# EAGLE design traffic_light (EAGLE 9.5.2)
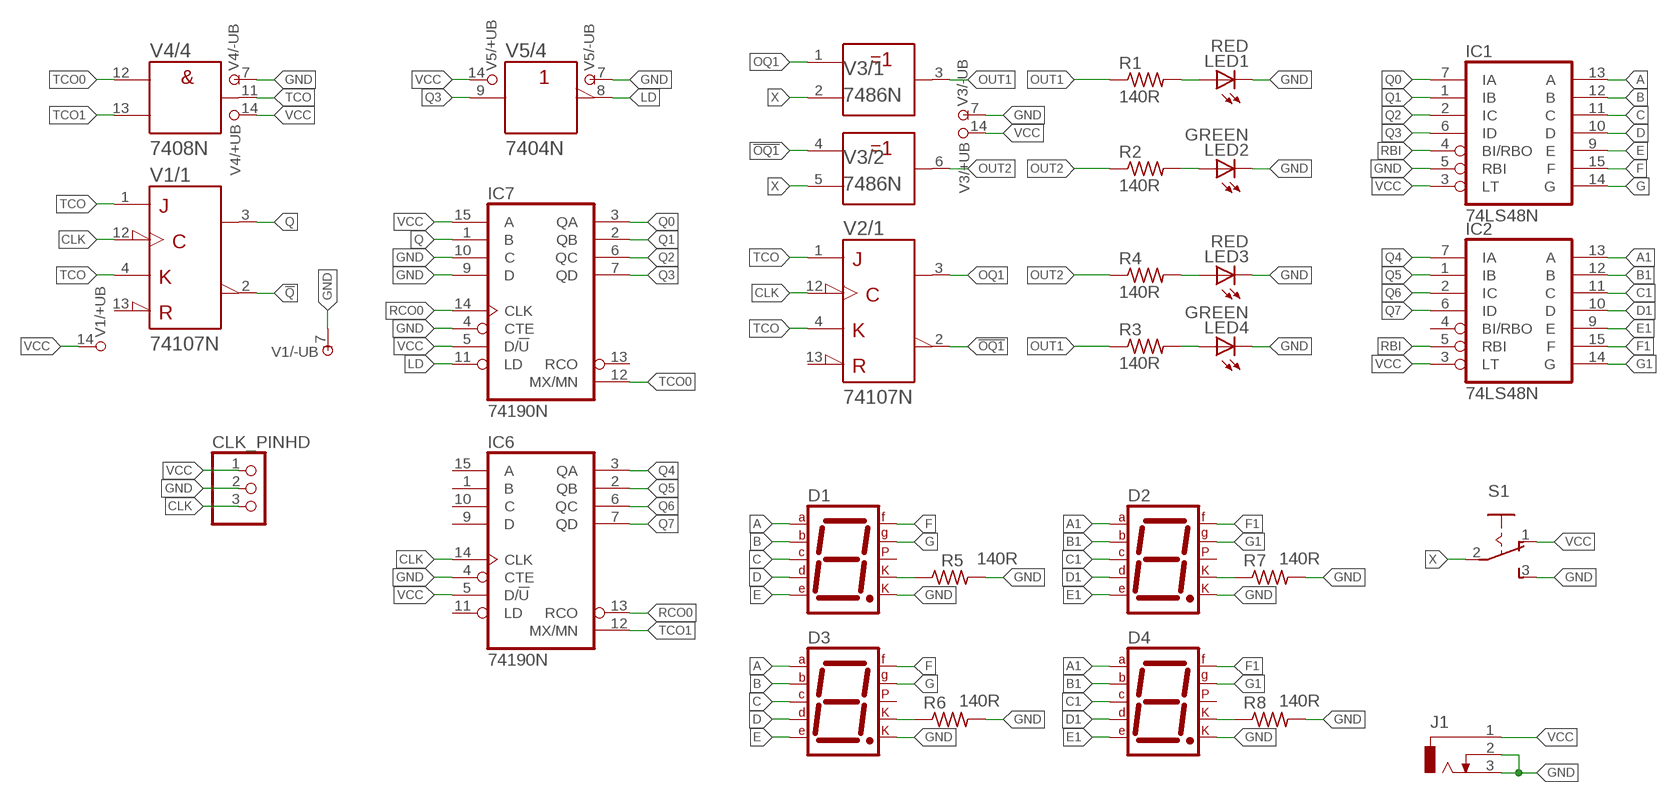
[diagram p0: schematic, sheet 1]

## Parts
CLK_PINHD  PINHD-1X3  [1X03]
D1  7SEG-CK  [7SEG-13]
D2  7SEG-CK  [7SEG-13]
D3  7SEG-CK  [7SEG-13]
D4  7SEG-CK  [7SEG-13]
IC1  74LS48N  [DIL16]
IC2  74LS48N  [DIL16]
IC6  74190N  [DIL16]
IC7  74190N  [DIL16]
J1  CON_JACK  [DCJ0303]
LED1  RED  LED5MM  [LED5MM]
LED2  GREEN  LED5MM  [LED5MM]
LED3  RED  LED5MM  [LED5MM]
LED4  GREEN  LED5MM  [LED5MM]
R1  140R  RES-7  [0204/7]
R2  140R  RES-7  [0204/7]
R3  140R  RES-7  [0204/7]
R4  140R  RES-7  [0204/7]
R5  140R  RES-7  [0204/7]
R6  140R  RES-7  [0204/7]
R7  140R  RES-7  [0204/7]
R8  140R  RES-7  [0204/7]
S1  255SB  [255SB]
V1  74107N  [DIL14]
V2  74107N  [DIL14]
V3  7486N  [DIL14]
V4  7408N  [DIL14]
V5  7404N  [DIL14]

## Nets
!OQ1: V2.2(/1:!Q) V3.4(/2:A)
!Q: V1.2(/1:!Q)
A: D1.7(A) D3.7(A) IC1.13(A)
A1: D2.7(A) D4.7(A) IC2.13(A)
B: D1.6(B) D3.6(B) IC1.12(B)
B1: D2.6(B) D4.6(B) IC2.12(B)
C: D1.4(C) D3.4(C) IC1.11(C)
C1: D2.4(C) D4.4(C) IC2.11(C)
CLK: CLK_PINHD.3 IC6.14(CLK) V1.12(/1:CLK) V2.12(/1:CLK)
D: D1.2(D) D3.2(D) IC1.10(D)
D1: D2.2(D) D4.2(D) IC2.10(D)
E: D1.1(E) D3.1(E) IC1.9(E)
E1: D2.1(E) D4.1(E) IC2.9(E)
F: D1.9(F) D3.9(F) IC1.15(F)
F1: D2.9(F) D4.9(F) IC2.15(F)
G: D1.10(G) D3.10(G) IC1.14(G)
G1: D2.10(G) D4.10(G) IC2.14(G)
GND: CLK_PINHD.2 D1.8(CK2) D2.8(CK2) D3.8(CK2) D4.8(CK2) IC1.5(RBI) IC6.4(CTE) IC7.4(CTE) IC7.9(D) IC7.10(C) J1.2 J1.3 LED1.K(C) LED2.K(C) LED3.K(C) LED4.K(C) R5.2 R6.2 R7.2 R8.2 S1.3(S) V1.7(/-UB:-UB) V3.7(/-UB:-UB) V4.7(/-UB:-UB) V5.7(/-UB:-UB)
LD: IC7.11(LD) V5.8(/4:Y)
N$1: D1.3(CK1) R5.1
N$2: D2.3(CK1) R7.1
N$3: D3.3(CK1) R6.1
N$4: D4.3(CK1) R8.1
N$27: LED1.A R1.2
N$29: LED2.A R2.2
N$31: LED3.A R4.2
N$33: LED4.A R3.2
OQ1: V2.3(/1:Q) V3.1(/1:A)
OUT1: R1.1 R3.1 V3.3(/1:Y)
OUT2: R2.1 R4.1 V3.6(/2:Y)
Q: IC7.1(B) V1.3(/1:Q)
Q0: IC1.7(IA) IC7.3(QA)
Q1: IC1.1(IB) IC7.2(QB)
Q2: IC1.2(IC) IC7.6(QC)
Q3: IC1.6(ID) IC7.7(QD) V5.9(/4:A)
Q4: IC2.7(IA) IC6.3(QA)
Q5: IC2.1(IB) IC6.2(QB)
Q6: IC2.2(IC) IC6.6(QC)
Q7: IC2.6(ID) IC6.7(QD)
RBI: IC1.4(BI/RBO) IC2.5(RBI)
RCO0: IC6.13(RCO) IC7.14(CLK)
TCO: V1.1(/1:J) V1.4(/1:K) V2.1(/1:J) V2.4(/1:K) V4.11(/4:Y)
TCO0: IC7.12(MX/MN) V4.12(/4:A)
TCO1: IC6.12(MX/MN) V4.13(/4:B)
VCC: CLK_PINHD.1 IC1.3(LT) IC2.3(LT) IC6.5(D/!U) IC7.5(D/!U) IC7.15(A) J1.1 S1.1(O) V1.14(/+UB:+UB) V3.14(/+UB:+UB) V4.14(/+UB:+UB) V5.14(/+UB:+UB)
X: S1.2(P) V3.2(/1:B) V3.5(/2:B)
Unconnected: D1.5(DP) D2.5(DP) D3.5(DP) D4.5(DP) IC2.4(BI/RBO) IC6.1(B) IC6.9(D) IC6.10(C) IC6.11(LD) IC6.15(A) IC7.13(RCO) V1.5(/2:Q) V1.6(/2:!Q) V1.8(/2:J) V1.9(/2:CLK) V1.10(/2:!CLR) V1.11(/2:K) V1.13(/1:!CLR) V2.5(/2:Q) V2.6(/2:!Q) V2.8(/2:J) V2.9(/2:CLK) V2.10(/2:!CLR) V2.11(/2:K) V2.13(/1:!CLR) V3.8(/3:Y) V3.9(/3:A) V3.10(/3:B) V3.11(/4:Y) V3.12(/4:A) V3.13(/4:B) V4.1(/1:A) V4.2(/1:B) V4.3(/1:Y) V4.4(/2:A) V4.5(/2:B) V4.6(/2:Y) V4.8(/3:Y) V4.9(/3:A) V4.10(/3:B) V5.1(/1:A) V5.2(/1:Y) V5.3(/2:A) V5.4(/2:Y) V5.5(/3:A) V5.6(/3:Y) V5.10(/5:Y) V5.11(/5:A) V5.12(/6:Y) V5.13(/6:A)

## Power pins joined to a net without a drawn wire
+UB: V2.14(/+UB:+UB)
-UB: V2.7(/-UB:-UB)
GND: IC1.8(GND) IC2.8(GND) IC6.8(GND) IC7.8(GND)
VCC: IC1.16(VCC) IC2.16(VCC) IC6.16(VCC) IC7.16(VCC)

## Library data of the parts
CLK_PINHD = MIA-Training:PINHD-1X3: PIN HEADER
D1-D4 = special:7SEG-CK: 7-segment DISPLAY single cathode, 13 mm
IC1 IC2 = 74xx-eu:74*48: BCD to seven segment DECODER/DRIVER
IC6 IC7 = 74xx-eu:74*190: Synchronous UP/DOWN COUNTER
J1 = MIA-Training:CON_JACK: DC POWER JACK Source: DCJ0303.pdf; OC_FARNELL: unknown; OC_NEWARK: unknown
LED1-LED4 = MIA_LIBRARY-2-2-2:LED5MM
R1-R8 = MIA_LIBRARY-2-2-2:RES-7
S1 = switch:255SB: SLIDING SWITCH Distributor Buerklin, 11G810
V1 V2 = 74ttl-din:74*107: Dual J-K FLIP FLOP, clear
V3 = 74ttl-din:74*86: Quad 2-input EXCLUSIV-OR gate
V4 = 74ttl-din:74*08: Quad 2-input AND gate
V5 = 74ttl-din:74*04: Hex INVERTER

## Board
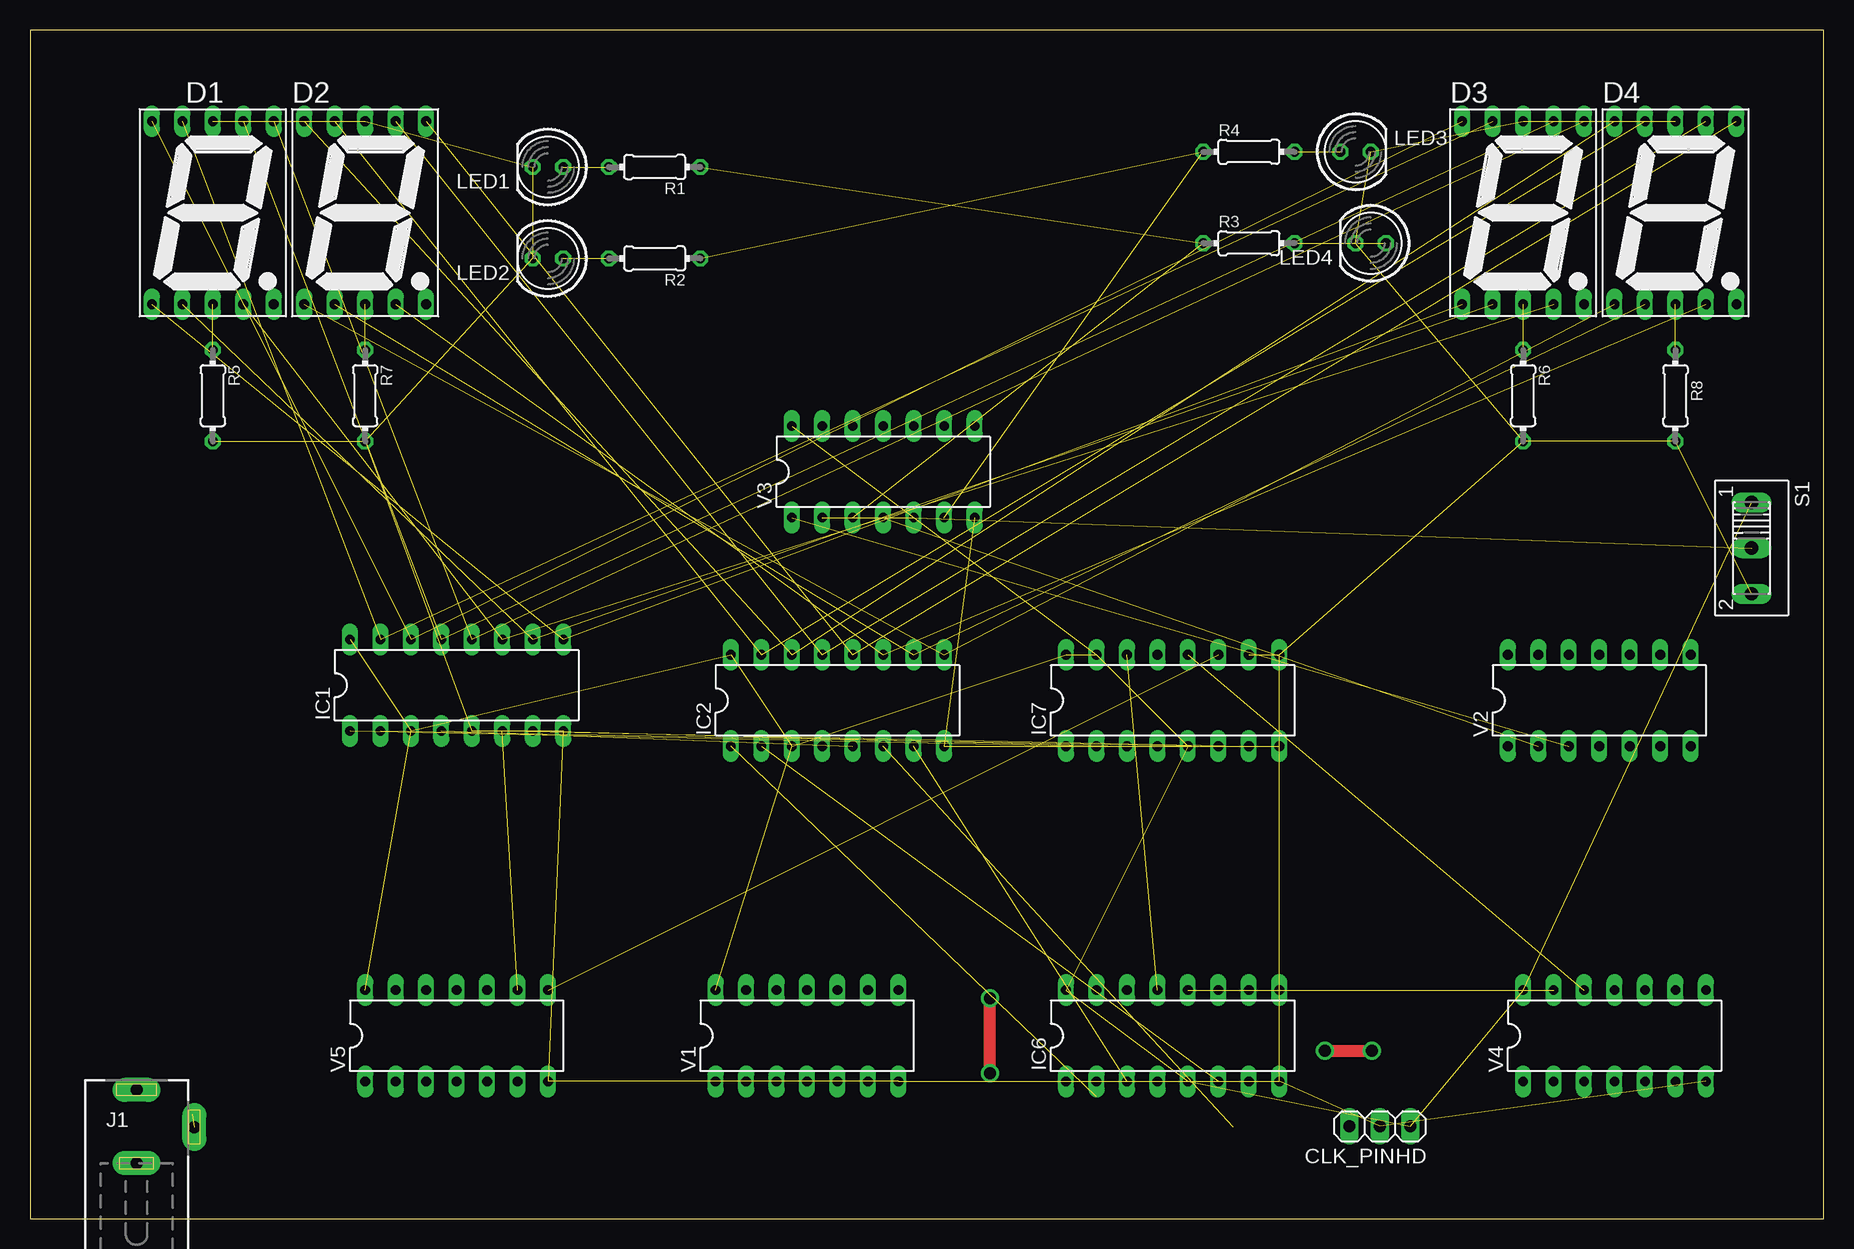
[diagram p1: board, top side]
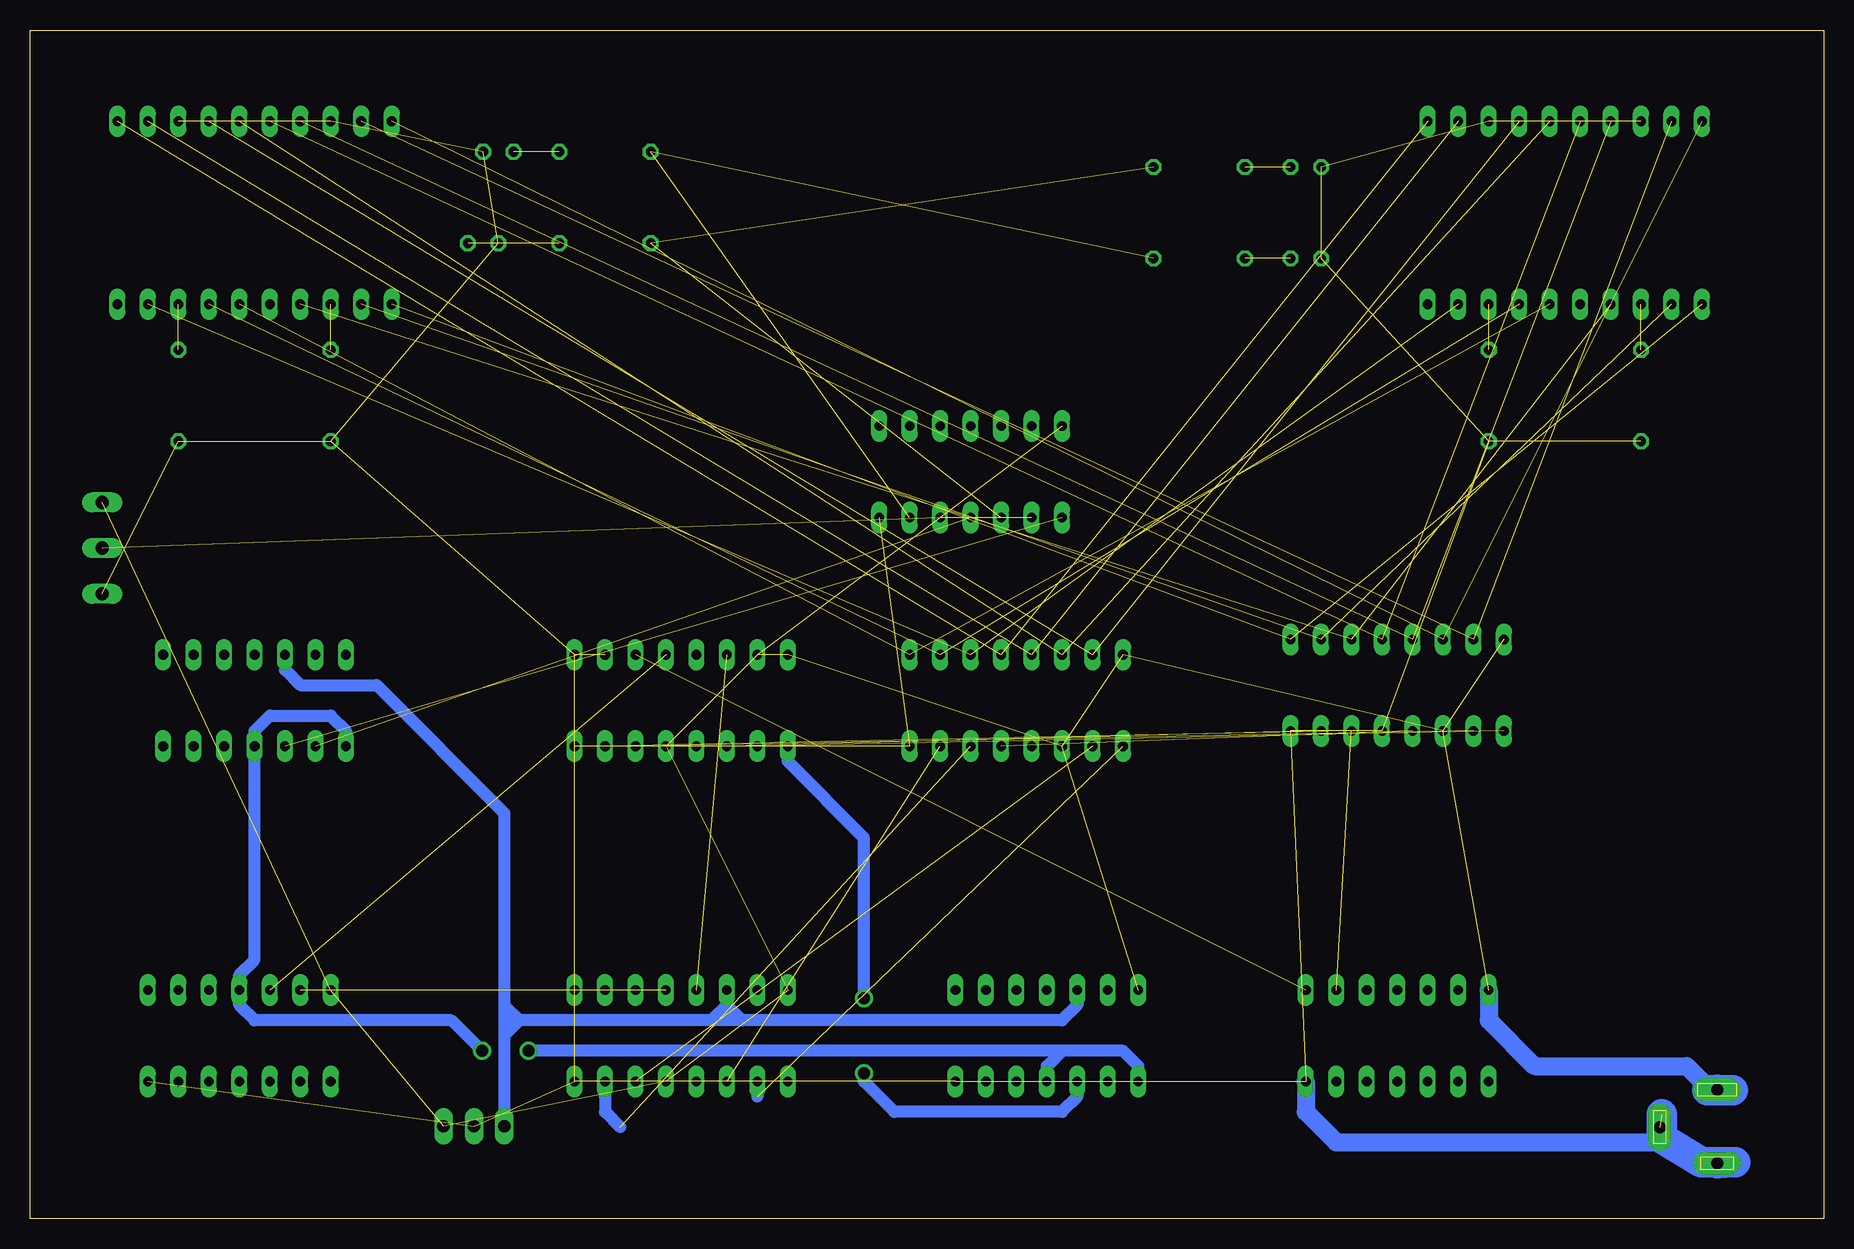
[diagram p2: board, bottom side, seen from below]

Size 149.53 x 99.05 mm. Coordinates in mm from the lower left corner, seen from the top.
Outline: 0,0 149.53,0 149.53,99.05 0,99.05 0,0
Copper layers (1*16): Top 0.035mm / dielectric 1.5mm / Bottom 0.035mm
Design rules "design_rules": minimum track width 0.8mm, minimum drill 1mm, track to track 0.6mm, track to pad 0.6mm, pad to pad 0.6mm, via to via 0.6mm, smd to smd 0.6mm, copper to edge 0.8mm, drill to drill 0.8mm, minimum pad ring 10mil, minimum via ring 8mil, stop-mask expansion 4mil, vias tented up to drill 0mil, thermal gap 10mil

### Footprints (pad centres in the part's own frame; a part is rotated, then mirrored left to right if it is on the bottom)
1X03 = drill 1.016 long: 1 -2.54,0; 2 0,0; 3 2.54,0
7SEG-13 = drill 0.813 long: 1 -5.08,-7.62; 2 -2.54,-7.62; 3 0,-7.62; 4 2.54,-7.62; 5 5.08,-7.62; 6 5.08,7.62; 7 2.54,7.62; 8 0,7.62; 9 -2.54,7.62; 10 -5.08,7.62
DIL16 = drill 0.813 long: 1 -8.89,-3.81; 2 -6.35,-3.81; 3 -3.81,-3.81; 4 -1.27,-3.81; 5 1.27,-3.81; 6 3.81,-3.81; 7 6.35,-3.81; 8 8.89,-3.81; 9 8.89,3.81; 10 6.35,3.81; 11 3.81,3.81; 12 1.27,3.81; 13 -1.27,3.81; 14 -3.81,3.81; 15 -6.35,3.81; 16 -8.89,3.81
DCJ0303 = drill 1 pad 2 long: 1 0,3.1; 2 4.8,0; 3 0,-3
LED5MM = drill 0.813 octagon: A -1.27,0; K 1.27,0
0204/7 = drill 0.813 octagon: 1 -3.81,0; 2 3.81,0
255SB = drill 1.118 long: 1 -3.81,0; 2 0,0; 3 3.81,0
DIL14 = drill 0.813 long: 1 -7.62,-3.81; 2 -5.08,-3.81; 3 -2.54,-3.81; 4 0,-3.81; 5 2.54,-3.81; 6 5.08,-3.81; 7 7.62,-3.81; 8 7.62,3.81; 9 5.08,3.81; 10 2.54,3.81; 11 0,3.81; 12 -2.54,3.81; 13 -5.08,3.81; 14 -7.62,3.81

### Placement (x,y rotation side)
CLK_PINHD  112.53,7.69 180 top
D1  15.24,83.82 0 top
D2  27.94,83.82 0 top
D3  124.46,83.82 0 top
D4  137.16,83.82 0 top
IC1  35.56,44.45 0 top
IC2  67.31,43.18 0 top
IC6  95.25,15.24 0 top
IC7  95.25,43.18 0 top
J1  8.89,7.62 0 top
LED1  43.18,87.63 180 top
LED2  43.18,80.01 180 top
LED3  110.49,88.9 0 top
LED4  111.76,81.28 180 top
R1  52.07,87.63 180 top
R2  52.07,80.01 180 top
R3  101.6,81.28 0 top
R4  101.6,88.9 0 top
R5  15.24,68.58 270 top
R6  124.46,68.58 270 top
R7  27.94,68.58 270 top
R8  137.16,68.58 270 top
S1  143.51,55.88 270 top
V1  64.77,15.24 0 top
V2  130.81,43.18 0 top
V3  71.12,62.23 0 top
V4  132.08,15.24 0 top
V5  35.56,15.24 0 top

### Tracks (layer width: path | path; a pad name or v marks a point on that pad's centre or on a via)
!OQ1  (1 unrouted)
A  (2 unrouted)
A1  (2 unrouted)
B  (2 unrouted)
B1  (2 unrouted)
C  (2 unrouted)
C1  (2 unrouted)
CLK
  Bottom 1.016: 109.99,17.78 109.99,16.51 | 109.99,16.51 109.99,15.24 | 109.99,15.24 CLK_PINHD.3 | V1.12 62.23,17.78 63.5,16.51 90.17,16.51 | 90.17,16.51 91.44,17.78 | 90.17,16.51 92.71,16.51 | 92.71,16.51 108.72,16.51 | 108.72,16.51 109.99,16.51 | IC6.14 91.44,17.78 | 91.44,17.78 92.71,16.51 | 109.99,17.78 108.72,16.51 | 109.99,15.24 108.72,16.51 | V2.12 128.27,45.72 127,44.45 120.65,44.45 109.99,33.79 109.99,17.78
D  (2 unrouted)
D1  (2 unrouted)
E  (2 unrouted)
E1  (2 unrouted)
F  (2 unrouted)
F1  (2 unrouted)
G  (2 unrouted)
G1  (2 unrouted)
GND  (27 unrouted)
  Bottom 1.5: J1.2 13.69,6.63 13.97,6.35 40.64,6.35 43.18,8.89 V5.7
  Bottom 2.54: J1.3 7.4,4.7 10.2,4.7 13.5,6.7 13.5,8.7
LD  (1 unrouted)
N$1  (1 unrouted)
N$2  (1 unrouted)
N$3  (1 unrouted)
N$4  (1 unrouted)
N$27  (1 unrouted)
N$29  (1 unrouted)
N$31  (1 unrouted)
N$33  (1 unrouted)
OQ1  (1 unrouted)
OUT1  (2 unrouted)
OUT2  (2 unrouted)
Q  (via drill 1)
  Top 1.016: v80.01,12.11 v80.01,18.37
  Bottom 1.016: V1.3 62.23,10.16 63.5,8.89 77.47,8.89 80.01,11.43 v80.01,12.11 | v80.01,18.37 80.01,31.75 86.36,38.1 IC7.1
Q0  (1 unrouted)
Q1  (1 unrouted)
Q2  (1 unrouted)
Q3  (2 unrouted)
Q4  (1 unrouted)
Q5  (1 unrouted)
  Bottom 1.016: IC6.2 88.9,10.16
Q6  (1 unrouted)
Q7  (1 unrouted)
  Bottom 1.016: IC6.7 101.6,10.16 101.6,8.89 100.33,7.62
RBI  (1 unrouted)
RCO0  (1 unrouted)
TCO  (via drill 1)
  Top 1.016: v107.95,13.97 v111.85,13.97
  Bottom 1.016: V2.1 123.19,40.64 124.46,41.91 129.54,41.91 130.81,40.64 V2.4 130.81,21.59 132.08,20.32 V4.11 132.08,17.78 130.81,16.51 114.39,16.51 v111.85,13.97 | V1.1 57.15,12.7 58.42,13.97 63.5,13.97 | 63.5,13.97 64.77,12.7 V1.4 | 63.5,13.97 v107.95,13.97
TCO0  (1 unrouted)
TCO1  (1 unrouted)
VCC  (14 unrouted)
  Bottom 1.5: V5.14 27.94,16.51 24.13,12.7 11.43,12.7 9.7,10.97 9.7,10.7
  Bottom 2.54: J1.1 7.6,10.7 9.7,10.7 J1.1
X  (2 unrouted)